# EAGLE design usblipocharger-own (EAGLE 6.1)
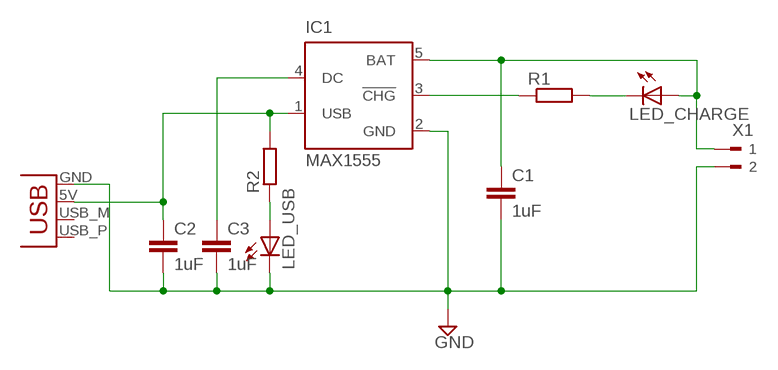
[diagram p0: schematic, sheet 1]

## Parts
C1  1uF  C-EUC0805  [C0805]
C2  1uF  C-EUC0805  [C0805]
C3  1uF  C-EUC0805  [C0805]
IC1  MAX1555  [SOT23-5L]
JP1  USBPCB  [USB-A-PCB]
LED_CHARGE  LEDCHIP-LED0805  [CHIP-LED0805]
LED_USB  LEDCHIP-LED0805  [CHIP-LED0805]
R1  R-EU_R0805  [R0805]
R2  R-EU_R0805  [R0805]
X1  180-2  [180-2]

## Nets
GND: C1.2 C2.2 C3.2 IC1.2(GND) JP1.GND LED_USB.C X1.2
LIPO+: C1.1 IC1.5(BAT) LED_CHARGE.A X1.1
N$1: LED_USB.A R2.1
N$2: C2.1 IC1.1(USB) JP1.5V(VBUS) R2.2
N$3: C3.1 IC1.4(DC)
N$6: IC1.3(!CHG) R1.1
N$7: LED_CHARGE.C R1.2
Unconnected: JP1.USB_M(D-) JP1.USB_P(D+)

## Library data of the parts
C1-C3 = rcl:C-EU: CAPACITOR, European symbol
IC1 = maxim:MAX1555: Dual-Input USB/AC Adapter 1-Cell Li+ Battery Chargers Source: http://www.maxim-ic.com .. MAX1551-MAX1555.pdf
JP1 = SparkFun-Connectors:USB: USB Connectors USB-B-PTH is fully proven SKU : PRT-00139/CONN-08278 USB-miniB is fully proven SKU : PRT-00587 USB-A-PCB is untested. USB-A-H is throughly reviewed, but untested. Spark Fun Electronics SKU : PRT-00437 USB-B-SMT is throughly reviewed, but untested. Needs silkscreen touching up. USB-A-S has not been used/tested USB-MB-H has not been used/tested USB-MICROB has been used. CONN-09505
LED_CHARGE LED_USB = led:LED: LED OSRAM: - CHIPLED LG R971, LG N971, LY N971, LG Q971, LY Q971, LO R971, LY R971 LH N974, LH R974 LS Q976, LO Q976, LY Q976 LO Q996 - Hyper CHIPLED LW Q18S LB Q993, LB Q99A, LB R99A - SideLED LS A670, LO A670, LY A670, LG A670, LP A670 LB A673, LV A673, LT A673, LW A673 LH A674 LY A675 LS A676, LA A676, LO A676, LY A676, LW A676 LS A679, LY A679, LG A679 - Hyper Micro SIDELED® LS Y876, LA Y876, LO Y876, LY Y876 LT Y87S - SmartLED LW L88C, LW L88S LB L89C, LB L89S, LG L890 LS L89K, LO L89K, LY L89K LS L896, LA L896, LO L896, LY L896 - TOPLED LS T670, LO T670, LY T670, LG T670, LP T670 LSG T670, LSP T670, LSY T670, LOP T670, LYG T670 LG T671, LOG T671, LSG T671 LB T673, LV T673, LT T673, LW T673 LH T674 LS T676, LA T676, LO T676, LY T676, LB T676, LH T676, LSB T676, LW T676 LB T67C, LV T67C, LT T67C, LS T67K, LO T67K, LY T67K, LW E67C LS E67B, LA E67B, LO E67B, LY E67B, LB E67C, LV E67C, LT E67C LW T67C LS T679, LY T679, LG T679 LS T770, LO T770, LY T770, LG T770, LP T770 LB T773, LV T773, LT T773, LW T773 LH T774 LS E675, LA E675, LY E675, LS T675 LS T776, LA T776, LO T776, LY T776, LB T776 LHGB T686 LT T68C, LB T68C - Hyper Mini TOPLED® LB M676 - Mini TOPLED Santana® LG M470 LS M47K, LO M47K, LY M47K Source: http://www.osram.convergy.de LUXEON: - LUMILED® LXK2-PW12-R00, LXK2-PW12-S00, LXK2-PW14-U00, LXK2-PW14-V00 LXK2-PM12-R00, LXK2-PM12-S00, LXK2-PM14-U00 LXK2-PE12-Q00, LXK2-PE12-R00, LXK2-PE12-S00, LXK2-PE14-T00, LXK2-PE14-U00 LXK2-PB12-K00, LXK2-PB12-L00, LXK2-PB12-M00, LXK2-PB14-N00, LXK2-PB14-P00, LXK2-PB14-Q00 LXK2-PR12-L00, LXK2-PR12-M00, LXK2-PR14-Q00, LXK2-PR14-R00 LXK2-PD12-Q00, LXK2-PD12-R00, LXK2-PD12-S00 LXK2-PH12-R00, LXK2-PH12-S00 LXK2-PL12-P00, LXK2-PL12-Q00, LXK2-PL12-R00 Source: www.luxeon.com KINGBRIGHT: KA-3528ASYC Source: www.kingbright.com
R1 R2 = rcl:R-EU_: RESISTOR, European symbol
X1 = con-weidmueller-sl35:180-2: WEIDMUELLER CLAMP CONNECTOR; OC_FARNELL: unknown; OC_NEWARK: unknown

## Board
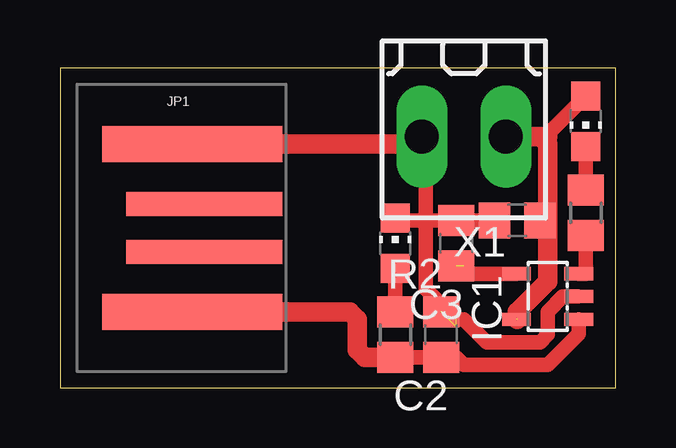
[diagram p1: board, top side]

Size 23.16 x 13.32 mm. Coordinates in mm from the lower left corner, seen from the top.
Outline: 0,0 23.16,0 23.16,13.32 0,13.32 0,0
Copper layers (1*16): Top 0.035mm / dielectric 1.5mm / Bottom 0.035mm
Design rules: minimum track width 10mil, minimum drill 24mil, track to track 8mil, track to pad 8mil, pad to pad 8mil, via to via 8mil, smd to smd 8mil, copper to edge 40mil, drill to drill 8mil, minimum pad ring 10mil, minimum via ring 8mil, stop-mask expansion 4mil, vias tented up to drill 0mil, thermal gap 10mil

### Footprints (pad centres in the part's own frame; a part is rotated, then mirrored left to right if it is on the bottom)
C0805 = smd 1.3 x 1.5: 1 -0.95,0; 2 0.95,0
SOT23-5L = smd 0.55 x 1.2: 1 -0.95,-1.3; 2 0,-1.3; 3 0.95,-1.3; 4 0.95,1.3; 5 -0.95,1.3
USB-A-PCB = smd 7.5 x 1.5: 5V -0.2,-3.5; GND -0.2,3.5 | smd 6.5 x 1: USB_M 0.3,-1; USB_P 0.3,1
CHIP-LED0805 = smd 1.2 x 1.2: A 0,-1.05; C 0,1.05
R0805 = smd 1.3 x 1.5: 1 -0.95,0; 2 0.95,0
180-2 = drill 1.422 long: 1 -1.75,0; 2 1.75,0

### Placement (x,y rotation side)
C1  19.05,6.99 180 top
C2  15.88,2.22 90 top
C3  16.51,6.03 90 top
IC1  20.32,3.81 90 top
JP1  5.71,6.67 0 top
LED_CHARGE  21.91,11.11 180 top
LED_USB  13.97,6.03 0 top
R1  21.91,7.3 90 top
R2  13.97,2.22 270 top
X1  16.83,10.48 180 top

### Tracks (layer width: path | path; a pad name or v marks a point on that pad's centre or on a via)
GND  (2 unrouted)
  Top 0.254: 21.59,3.81 IC1.2
  Top 0.61: 15.24,6.99 14.38,6.99 14.29,7.08 LED_USB.C | 15.24,6.99 15.24,4.13 16.19,3.17 C2.2 16.51,2.86 16.83,2.86 17.78,1.91 20,1.91 20.32,2.22 20.32,3.17 20.95,3.81 21.59,3.81 | 15.24,6.99 16.82,6.99 | 16.82,6.99 C3.2 | 15.24,10.16 15.24,6.99 | 16.82,6.99 C1.2
  Top 0.813: JP1.GND 7.11,10.16 15.24,10.16 15.24,10.48 X1.2
LIPO+  (1 unrouted)
  Top 0.61: 20,10.48 20.22,10.48 LED_CHARGE.A
  Top 0.813: 19.05,2.86 19.05,3.17 20.32,4.45 20.32,6.99 | X1.1 20,10.48 | 20,10.48 20.32,10.48 | 20.32,6.99 20.32,10.16 20,10.48 | C1.1 20.32,6.99
N$1
  Top 0.61: R2.1 LED_USB.A
N$2
  Top 0.254: 16.51,1.27 C2.1
  Top 0.61: 14.29,1.27 C2.1 | IC1.1 21.62,2.25 20.32,0.95 16.83,0.95 16.51,1.27 C2.1 | 14.29,1.27 R2.2
  Top 0.813: 14.29,1.27 | R2.2 12.7,1.27 12.38,1.59 12.38,2.86 12.06,3.17 6.03,3.17 6.04,3.17 JP1.5V
N$3  (1 unrouted)
  Top 0.61: IC1.4 17.15,4.76 16.83,5.08
N$6
  Top 0.61: IC1.3 21.91,4.76 R1.1
N$7
  Top 0.61: R1.2 LED_CHARGE.C